# Altium project CVSP1 2020.PrjPCB
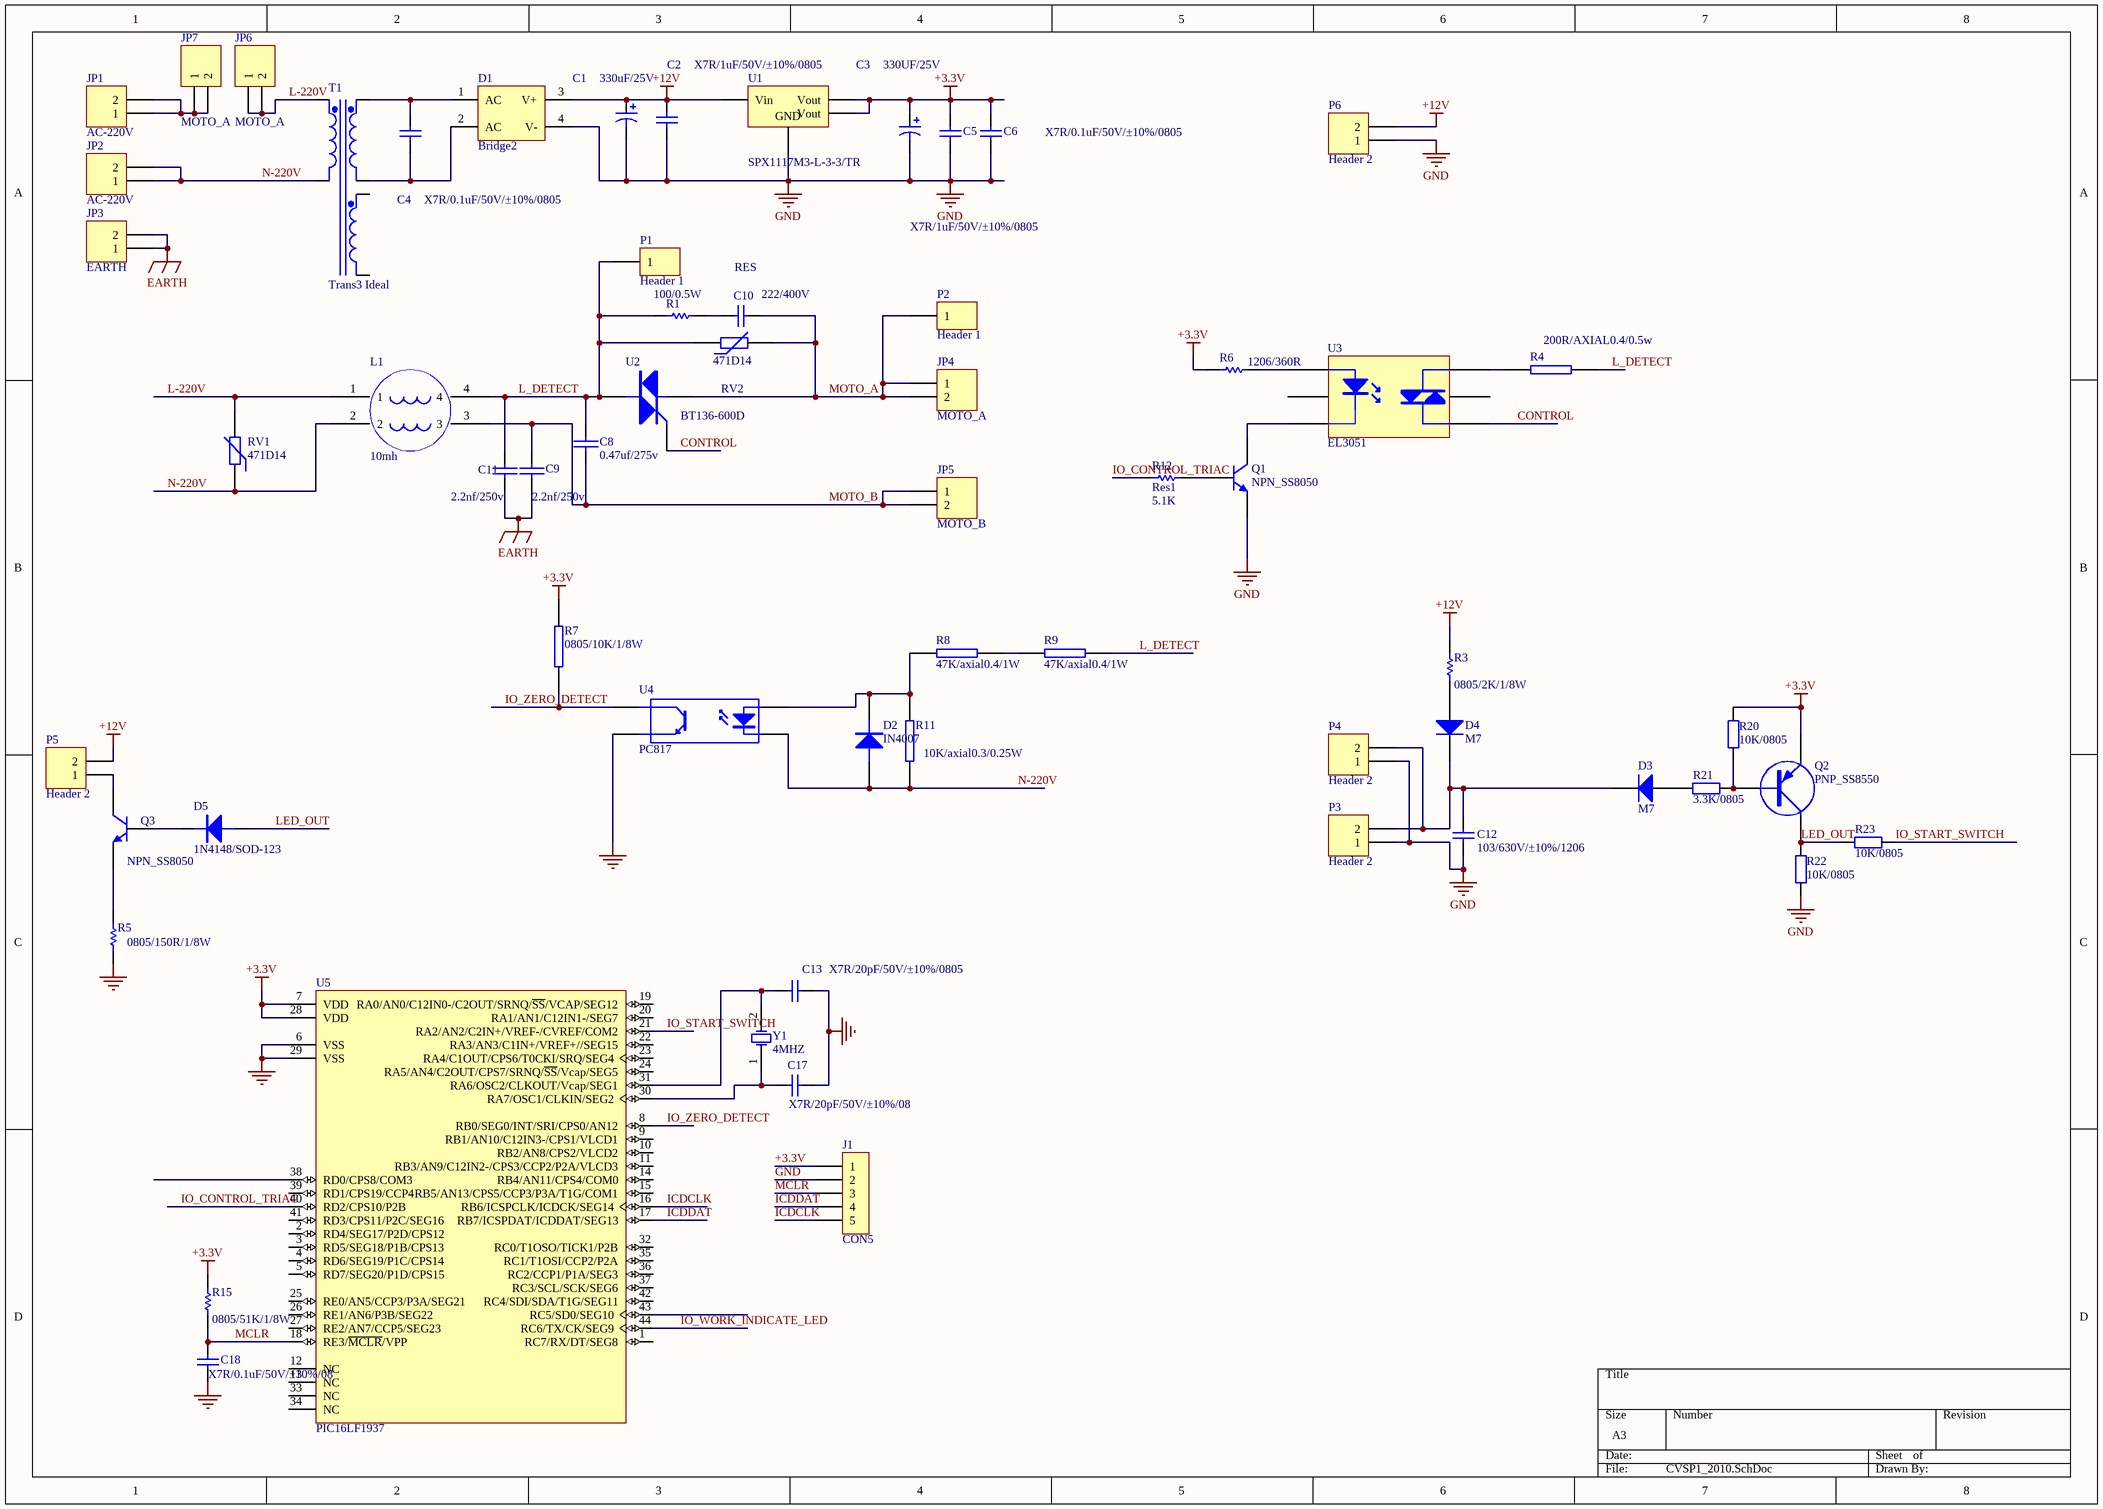
[diagram p0: CVSP1_2010.SchDoc]
1 sheet, 61 parts. Net scope: global (net labels, ports and power ports of the same name join across sheets).
Board files: 10515.0502_CVSP1_2020（2拼版）2020.1019.PcbDoc, 10515.0502_CVSP1_2020 1P.PcbDoc

## Sheet CVSP1_2010.SchDoc
size A3

### Parts
C1  value 330uF/25V  [CAP/3.2mm*12mm*8mm]  (hidden comment: Cap Pol1)
C2  value X7R/1uF/50V/±10%/0805  [0805C]  (hidden comment: Cap)
C3  value 330UF/25V  [CAP/3.2mm*12mm*8mm]  (hidden comment: Cap Pol1)
C4  X7R/0.1uF/50V/±10%/0805  [0805C]
C5  value X7R/1uF/50V/±10%/0805  [0805C]  (hidden comment: 0805/105/25V)
C6  X7R/0.1uF/50V/±10%/0805  [0805C]
C8  0.47uf/275v  [CAP/0.47U/250V]
C9  2.2nf/250v  [CAP/1KV]
C10  value 222/400V  [CAP/1KV]  (hidden comment: Cap)
C11  2.2nf/250v  [CAP/1KV]
C12  value 103/630V/±10%/1206  [0805C]  (hidden comment: Cap)
C13  value X7R/20pF/50V/±10%/0805  [0805C]  (hidden comment: Cap)
C17  value X7R/20pF/50V/±10%/08  [0805C]  (hidden comment: Cap)
C18  value X7R/0.1uF/50V/±10%/08  [0805R]  (hidden comment: 0805/104/25V)
D1  Bridge2  [MB6S(SMT-4)]
D2  IN4007  [M7]
D3  M7  [M7]
D4  M7  [M7]
D5  1N4148/SOD-123  [D/SMT/SOD-123]
J1  CON5  [CON_LCD3]
JP1  AC-220V  [CON-1PIN]
JP2  AC-220V  [CON-1PIN]
JP3  EARTH  [CON-1PIN]
JP4  MOTO_A  [CON-1PIN]
JP5  MOTO_B  [CON-1PIN]
JP6  MOTO_A  [CON-1PIN]
JP7  MOTO_A  [CON-1PIN]
L1  10mh  [L1]
P1  Header 1  [CON/1PIN]
P2  Header 1  [CON/1PIN]
P3  Header 2  [CON-4.0MM*2]
P4  Header 2  [CON-4.0MM*2]
P5  Header 2  [CON-4.0MM*2]
P6  Header 2  [CON-4.0MM*2]
Q1  NPN_SS8050  [BJT/SMT/SOT-23]
Q2  PNP_SS8550  [BJT/SMT/SOT-23]
Q3  NPN_SS8050  [BJT/SMT/SOT-23]
R1  RES  value 100/0.5W  [R(DIP/0.25W)]
R3  value 0805/2K/1/8W  [0805R]  (hidden comment: Res1)
R4  200R/AXIAL0.4/0.5w  [RDIP/0.4/0.5W]
R5  value 0805/150R/1/8W  [0805R]  (hidden comment: Res1)
R6  value 1206/360R  [1206R]  (hidden comment: Res1)
R7  0805/10K/1/8W  [0805R]
R8  47K/axial0.4/1W  [0805R]
R9  47K/axial0.4/1W  [R(DIP/0.25W)]
R11  10K/axial0.3/0.25W  [R[DIP/0.3/0.25W]]
R12  Res1  value 5.1K  [0805R]
R15  value 0805/51K/1/8W  [0805R]  (hidden comment: Res1)
R20  value 10K/0805  [0805R]  (hidden comment: Res2)
R21  value 3.3K/0805  [0805R]  (hidden comment: Res2)
R22  value 10K/0805  [0805R]  (hidden comment: Res2)
R23  value 10K/0805  [0805R]  (hidden comment: Res2)
RV1  471D14  [RES/RY/TDK471KD14]
RV2  471D14  [RES/RY/TDK471KD14]
T1  Trans3 Ideal  [TRANS1]
U1  SPX1117M3-L-3-3/TR  [SOT-223]
U2  BT136-600D  [BTA41_800B]
U3  EL3051  [MOC3052(DIP-6)]
U4  PC817  [PC817(DIP-4)]
U5  PIC16LF1937  [TQFP44]
Y1  4MHZ  [Y1(DIP-5.08mm)]

### Nets
+3.3V: C3.1 C5.2 C6.2 J1.1 Q2.2(E) R6.1 R7.2 R15.2 R20.2 U1.2(Vout) U1.4(Vout) U5.7(VDD) U5.28(VDD)
+12V: C1.1 C2.2 D1.3(V+) P5.2 P6.2 R3.2 U1.3(Vin)
EARTH: C9.1 C11.1 JP3.1 JP3.2
GND: C1.2 C2.1 C3.2 C5.1 C6.1 C12.1 C13.1 C17.1 C18.1 D1.4(V-) J1.2 P3.1 P4.1 P6.1 Q1.2(E) R5.1 R22.1 U1.1(GND) U4.3(E) U5.6(VSS) U5.29(VSS)
CONTROL: U2.3(G) U3.4
ICDCLK: J1.5 U5.16(RB6/ICSPCLK/ICDCK/SEG14)
ICDDAT: J1.4 U5.17(RB7/ICSPDAT/ICDDAT/SEG13)
IO_CONTROL_TRIAC: R12.1 U5.40(RD2/CPS10/P2B)
IO_START_SWITCH: R23.1 U5.21(RA2/AN2/C2IN+/VREF-/CVREF/COM2)
IO_WORK_INDICATE_LED: U5.44(RC6/TX/CK/SEG9)
IO_ZERO_DETECT: R7.1 U4.4(C) U5.8(RB0/SEG0/INT/SRI/CPS0/AN12)
L-220V: JP6.1 JP6.2 L1.1 RV1.2 T1.1(Pri+)
L_DETECT: C8.2 C11.2 L1.4 P1.1 R1.1 R4.2 R9.1 RV2.1 U2.2(T)
LED_OUT: D5.2(A) Q2.3(C) R22.2 R23.2
MCLR: C18.2 J1.3 R15.1 U5.18(RE3/~{MCLR}/VPP)
MOTO_A: C10.1 JP4.1 JP4.2 P2.1 RV2.2 U2.1(T)
MOTO_B: C8.1 C9.2 JP5.1 JP5.2 L1.3
N-220V: D2.1(A) JP2.1 JP2.2 L1.2 R11.1 RV1.1 T1.2(Pri-) U4.2(K)
NetC4_1: C4.1 D1.2(AC) T1.4(Sec1-)
NetC4_2: C4.2 D1.1(AC) T1.3(Sec1+)
NetC10_2: C10.2 R1.2
NetC12_2: C12.2 D3.2(K) D4.2(K) P3.2 P4.2
NetC13_2: C13.2 U5.31(RA6/OSC2/CLKOUT/Vcap/SEG1) Y1.2(OSC2)
NetC17_2: C17.2 U5.30(RA7/OSC1/CLKIN/SEG2) Y1.1(OSC1)
NetD2_2: D2.2(K) R8.2 R11.2 U4.1(A)
NetD3_1: D3.1(A) R21.1
NetD4_1: D4.1(A) R3.1
NetD5_1: D5.1(K) Q3.1(B)
NetJP1_1: JP1.1 JP1.2 JP7.1 JP7.2
NetP5_1: P5.1 Q3.3(C)
NetQ1_1: Q1.1(B) R12.2
NetQ1_3: Q1.3(C) U3.2
NetQ2_1: Q2.1(B) R20.1 R21.2
NetQ3_2: Q3.2(E) R5.2
NetR4_1: R4.1 U3.6
NetR6_2: R6.2 U3.1
NetR8_1: R8.1 R9.2

Not connected (* = marked no-connect by the designer): T1 5(Sec2+) 6(Sec2-); U3 3 5; U5 1(RC7/RX/DT/SEG8) 2(RD4/SEG17/P2D/CPS12) 3(RD5/SEG18/P1B/CPS13) 4(RD6/SEG19/P1C/CPS14) 5(RD7/SEG20/P1D/CPS15) 9(RB1/AN10/C12IN3-/CPS1/VLCD1) 10(RB2/AN8/CPS2/VLCD2) 11(RB3/AN9/C12IN2-/CPS3/CCP2/P2A/VLCD3) 12(NC) 13(NC) 14(RB4/AN11/CPS4/COM0) 15(RB5/AN13/CPS5/CCP3/P3A/T1G/COM1) 19(RA0/AN0/C12IN0-/C2OUT/SRNQ/~{SS}/VCAP/SEG12) 20(RA1/AN1/C12IN1-/SEG7) 22(RA3/AN3/C1IN+/VREF+//SEG15) 23(RA4/C1OUT/CPS6/T0CKI/SRQ/SEG4) 24(RA5/AN4/C2OUT/CPS7/SRNQ/~{SS}/Vcap/SEG5) 25(RE0/AN5/CCP3/P3A/SEG21) 26(RE1/AN6/P3B/SEG22) 27(RE2/AN7/CCP5/SEG23) 32(RC0/T1OSO/TICK1/P2B) 33(NC) 34(NC) 35(RC1/T1OSI/CCP2/P2A) 36(RC2/CCP1/P1A/SEG3) 37(RC3/SCL/SCK/SEG6) 38(RD0/CPS8/COM3) 39(RD1/CPS19/CCP4) 41(RD3/CPS11/P2C/SEG16) 42(RC4/SDI/SDA/T1G/SEG11) 43(RC5/SD0/SEG10)

### Library data of the parts
C1 C3 = Cap Pol1: Polarized Capacitor (Radial); Published: 8-Jun-2000; LatestRevisionDate: 17-Jul-2002; LatestRevisionNote: Re-released for DXP Platform.; PackageReference: RB7.6-15; Publisher: Altium Limited
C2 C4 C5 C10 C12 C13 C17 C18 = Cap: Capacitor; Published: 8-Jun-2000; LatestRevisionDate: 17-Jul-2002; LatestRevisionNote: Re-released for DXP Platform.; PackageReference: RAD-0.3; Publisher: Altium Limited
  C4: Value: X7R/0.1uF/50V/±10%/0805
C6 = Cap: Capacitor; Value: 0805/104/25V; Published: 8-Jun-2000; LatestRevisionDate: 17-Jul-2002; LatestRevisionNote: Re-released for DXP Platform.; PackageReference: RAD-0.3; Publisher: Altium Limited
C8 C9 C11 = CAP: Capacitor
D1 = Bridge2: Diode Bridge; Published: 24-Mar-1999; LatestRevisionDate: 17-Jul-2002; LatestRevisionNote: Re-released for DXP Platform.; PackageReference: D-46_6A; Publisher: Altium Limited
D2 = DIODE
D3 D4 = Diode 1N4007: 1 Amp General Purpose Rectifier; Published: 8-Jun-2000; LatestRevisionDate: 17-Jul-2002; LatestRevisionNote: Re-released for DXP Platform.; DatasheetVersion: 1998; PackageVersion: Aug-1999; PackageReference: DO-41; Publisher: Altium Limited; PackageDescription: Diode, Axial; Body 5.2 x 2.7 mm (LxDia. max), Lead Dia. 0.86 mm (max); Code_JEDEC: DO-204-AL; ComponentLink1Description: Manufacturer Link; ComponentLink1URL: http://www.fairchildsemi.com/; ComponentLink2Description: Datasheet; ComponentLink2URL: http://www.fairchildsemi.com/ds/1N%2F1N4001.pdf
D5 = D/D/SMT/1N4148/SOD-123: VR=75V T(-65-175)P(0.5W)VF=0.6V
J1 = CON5: Connector
JP1-JP7 P3-P6 = Header 2: Header, 2-Pin; LatestRevisionDate: 17-Jul-2002; LatestRevisionNote: Re-released for DXP Platform.; Publisher: Altium Limited
L1 = INDUCTANCE
P1 P2 = Header 1: Header, 2-Pin; LatestRevisionDate: 17-Jul-2002; LatestRevisionNote: Re-released for DXP Platform.; Publisher: Altium Limited
Q1 Q3 = BJT/NPN/SMT/SS8050/SOT-23: Published: *; Publisher: *; Manufacturer: *; Class: *; SubClass: *
Q2 = BJT/PNP/SMT/SS8550/SOT-23: Vce25V/Vcb40V/Veb5V/Ic1.5V/Pd300mW
R1 R3 R5 R6 R12 R15 = Res1: Resistor; Published: 8-Jun-2000; LatestRevisionDate: 17-Jul-2002; LatestRevisionNote: Re-released for DXP Platform.; PackageReference: AXIAL-0.3; Publisher: Altium Limited
R4 R7-R9 R11 = RES2
R20-R23 = Res2: Resistor; Published: 8-Jun-2000; LatestRevisionDate: 17-Jul-2002; LatestRevisionNote: Re-released for DXP Platform.; PackageReference: AXIAL-0.4; Publisher: Altium Limited; PackageDescription: Axial Device, Thru-Hole; 2 Leads; 0.4 in Pin Spacing
RV1 RV2 = Res Varistor: Varistor (Voltage-Sensitive Resistor); Published: 24-Mar-1999; LatestRevisionDate: 29-May-2009; LatestRevisionNote: IPC-7351 Footprint Added.; PackageVersion: Mar-2003; PackageReference: 6-0805; Publisher: Altium Limited; PackageDescription: Chip Resistor 0805 Case Size; Code_IPC: RESC2012
T1 = Trans3 Ideal: Three-winding Transformer (Ideal); Published: 25-Jan-2001; LatestRevisionDate: 17-Jul-2002; LatestRevisionNote: Re-released for DXP Platform.; PackageReference: TRF_6; Publisher: Altium Limited
U1 = SPX3117: Voltage Regulator; Published: 24-Mar-1999; LatestRevisionDate: 29-May-2009; LatestRevisionNote: IPC-7351 Footprint Added.; PackageReference: D2PAK; Publisher: Altium Limited; PackageDescription: 3-Pin Transistor Outline Package 2.54 mm Pitch, 15.1 mm Lead Span
U2 = TRIAC
U3 = MOC3043
U4 = OPTOISO1: Optoisolator
U5 = PIC16LF1937: Flash-Based, 8-Bit CMOS Microcontroller with LCD Driver and nanoWatt Technology, 4K (x14-Bit words) Program Memory, 512 Bytes Data Memory, 35 I/O pins, 44-Pin TQFP, Standard VDD Range, Extended Temperature; FirstPublished: 29-Jan-2009; DatasheetVersion: revF, May-2007; PackageVersion: revBB, Aug-2009; PackageReference: TQFP-PT44; Publisher: Altium Limited; PackageDescription: 44-Lead Plastic Thin Quad Flatpack (PT) - 10x10x1mm Body, 2.00mm [TQFP]; Supplier 1: Digi-Key; Supplier Part Number 1: PIC16F914-E/PT-ND; Supplier 2: Newark; Supplier Part Number 2: 56J7591; Code_JEDEC: MS-026; ComponentLink1Description: Datasheet; ComponentLink1URL: http://ww1.microchip.com/downloads/en/DeviceDoc/41250F.pdf; ComponentLink2Description: Packaging Specification; ComponentLink2URL: http://www.microchip.com/stellent/groups/techpub_sg/documents/packagingspec/en012702.pdf; ComponentLink3Description: Microchip.com Home; ComponentLink3URL: http://www.microchip.com/
Y1 = XTAL: Crystal Oscillator; Published: 8-Jun-2000; LatestRevisionDate: 17-Jul-2002; LatestRevisionNote: Re-released for DXP Platform.; PackageReference: R38; Publisher: Altium Limited